# Altium schematic sheet Discuss.SchDoc
size A4
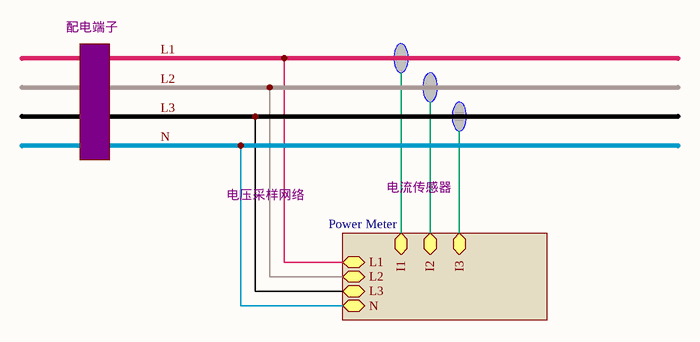
[diagram p0: Discuss.SchDoc]

## Sub-sheets
Power Meter = ?: L1, L2, L3, N, I1, I2, I3
? = ?: no entries

## Nets
L1: sheet Power Meter/L1
L2: sheet Power Meter/L2
L3: sheet Power Meter/L3
N: sheet Power Meter/N

## Notes on the sheet
- 配电端子
- 电压采样网络
- 电流传感器